# Altium schematic sheet MODULIQ_POE_SPI.SchDoc: Ethernet + PoE
size A3; Author: M.Beldyga; CompanyName: WUT ISE; DrawnBy: M.Beldyga; Organization: WUT ISE; Address1: PW ISE; Address2: Nowowiejska 15/19 00-665 Warsaw; Address3: micbeldyga@gmail.com; SheetNumber: 1; SheetTotal: 1; ModifiedBy: -; CheckedDate: -; Title2: MODULIQ; DivGrp: WUT ISE; Designer: M.Beldyga; ModifiedDate: -; ProjectName: Sensor Box
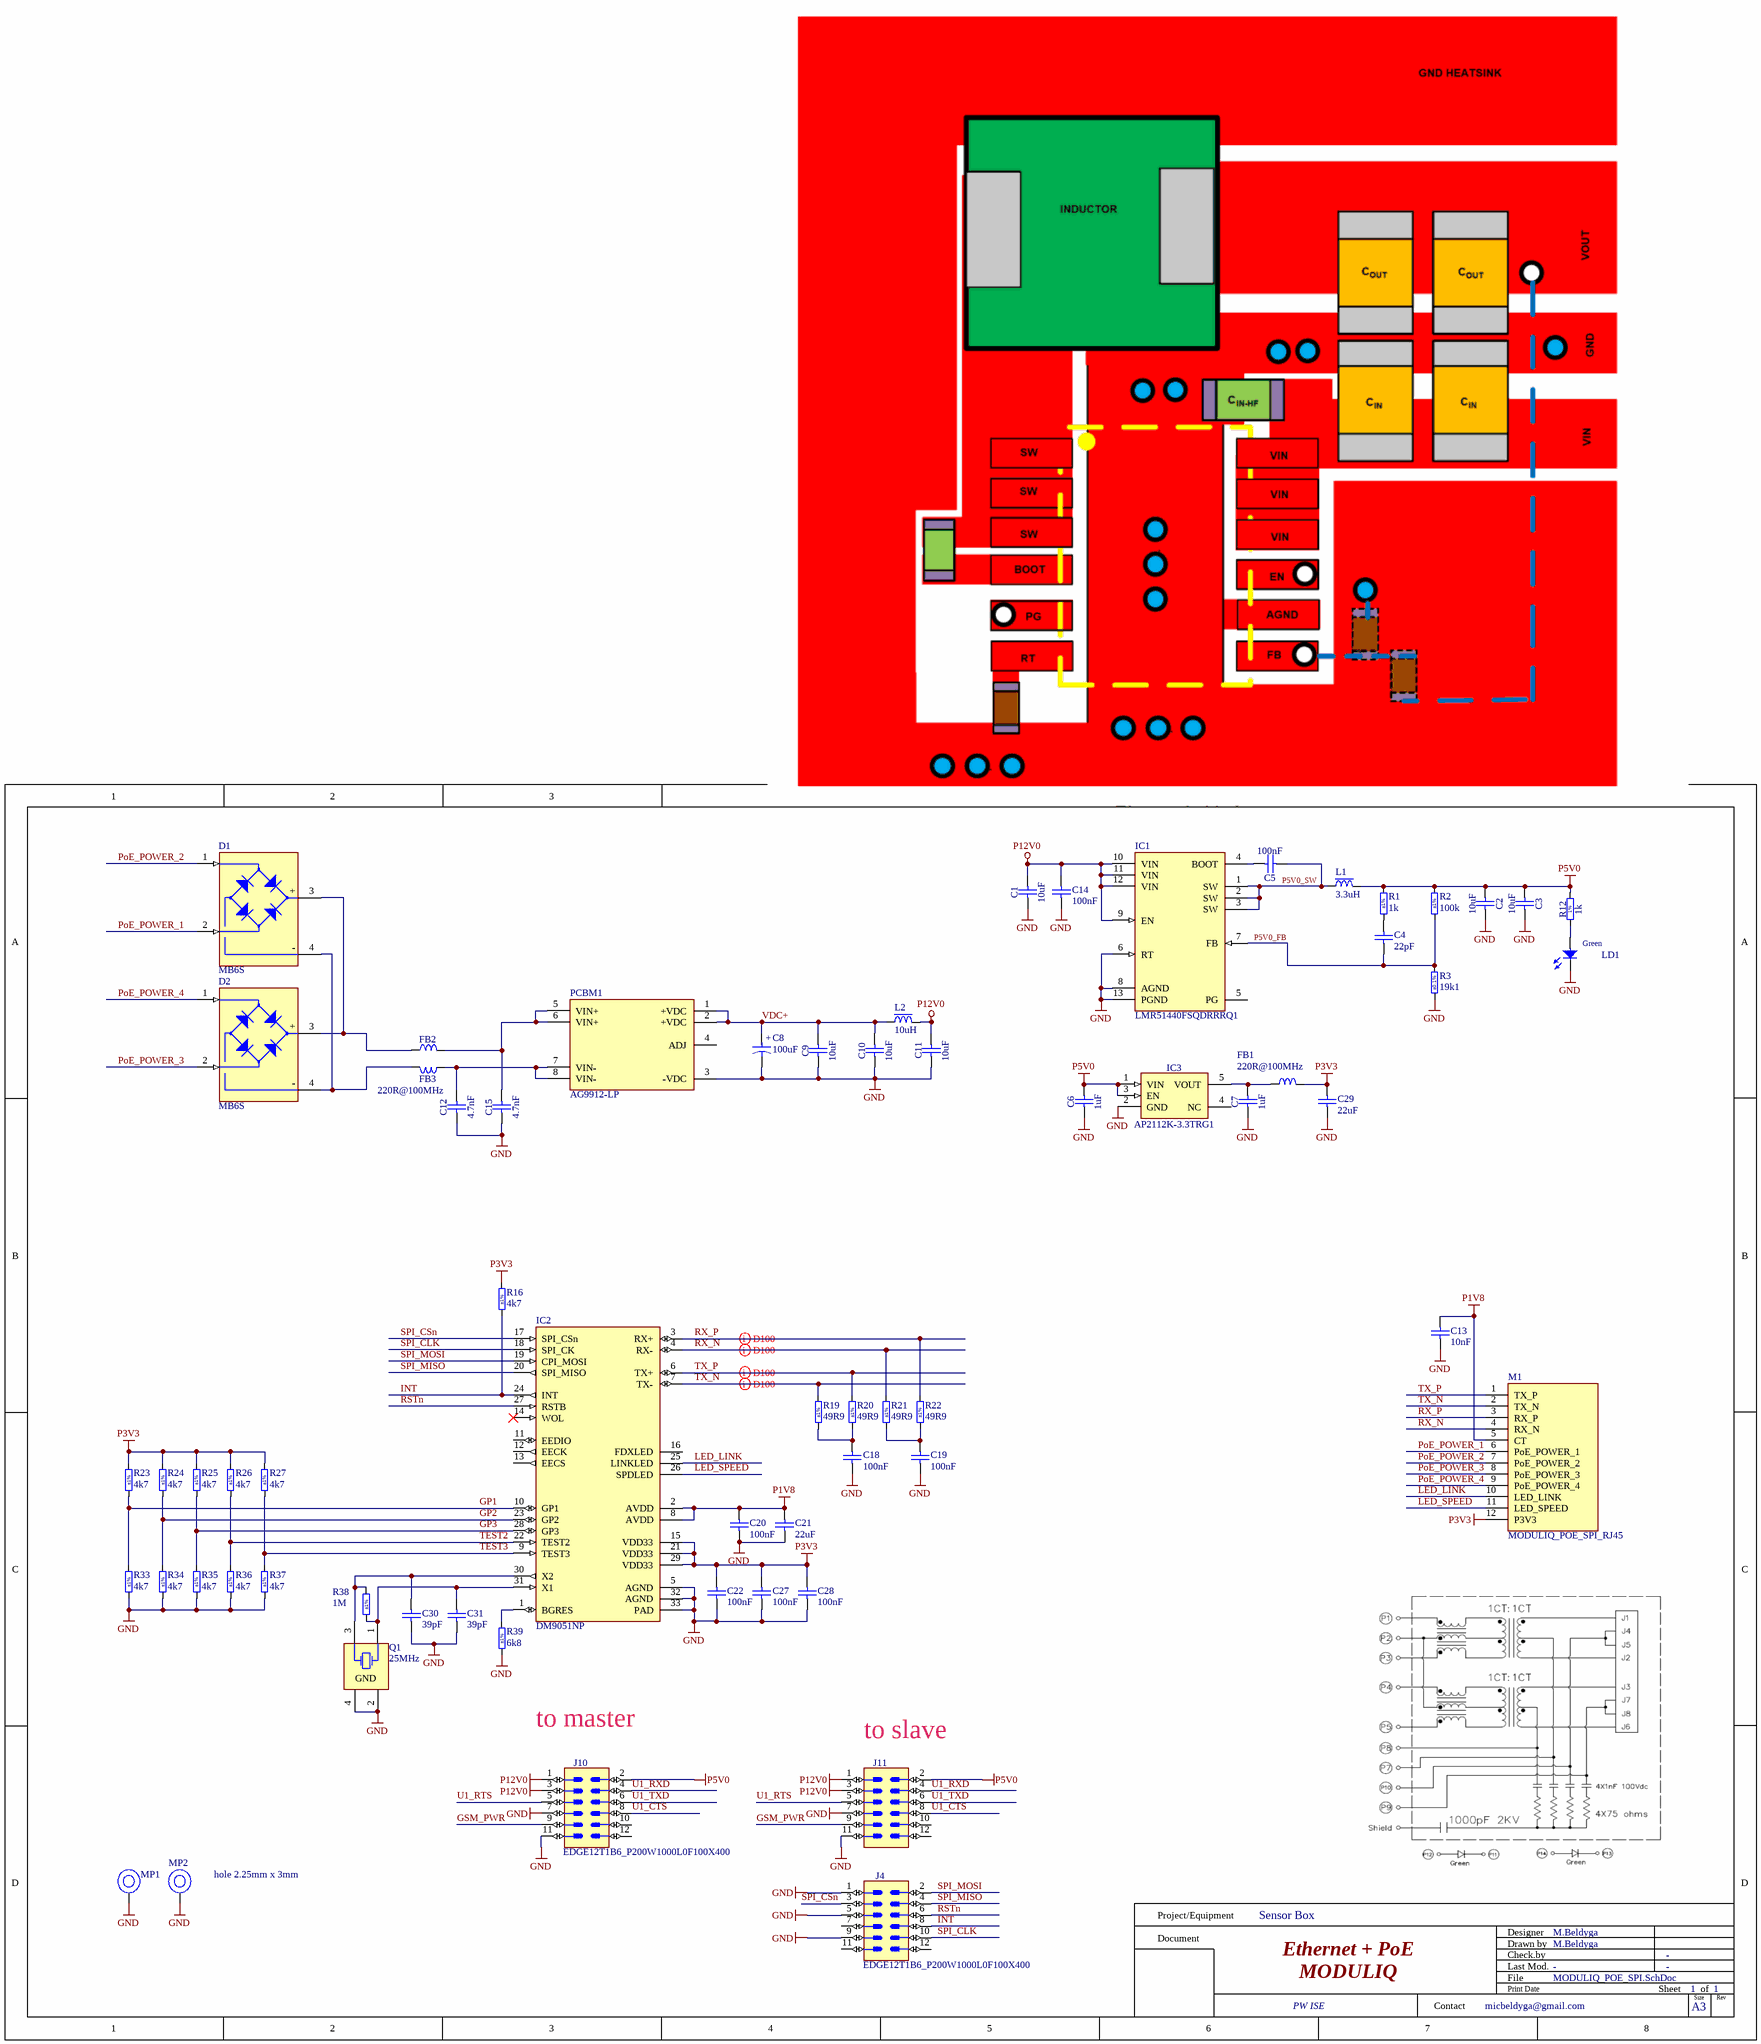
[diagram p0: MODULIQ_POE_SPI.SchDoc]

## Parts
C1  10uF  [CAPC2012X135N]
C2  10uF  [CAPC2012X135N]
C3  10uF  [CAPC2012X135N]
C4  22pF  [CAPC1005X55N]
C5  100nF  [CAPC1005X55N]
C6  1uF  [CAPC1005X55N]
C7  1uF  [CAPC1005X55N]
C8  100uF  [CAPMP7343X430N]
C9  10uF  [CAPC2012X135N]
C10  10uF  [CAPC2012X135N]
C11  10uF  [CAPC2012X135N]
C12  4.7nF  [CAPC3216X140N]
C13  10nF  [CAPC1608X87N]
C14  100nF  [CAPC1005X55N]
C15  4.7nF  [CAPC3216X140N]
C18  100nF  [CAPC1005X55N]
C19  100nF  [CAPC1005X55N]
C20  100nF  [CAPC1005X55N]
C21  22uF  [CAPC1005X70N]
C22  100nF  [CAPC1005X55N]
C27  100nF  [CAPC1005X55N]
C28  100nF  [CAPC1005X55N]
C29  22uF  [CAPC1005X70N]
C30  39pF  [CAPC1005X55N]
C31  39pF  [CAPC1005X55N]
D1  MB6S  [SOIC254P665X290-4N]
D2  MB6S  [SOIC254P665X290-4N]
FB1  220R@100MHz  [INDC2012X105N]
FB2  220R@100MHz  [INDC2012X105N]  (value not drawn)
FB3  220R@100MHz  [INDC2012X105N]
IC1  LMR51440FSQDRRRQ1  [SON50P300X80_HS-13N]
IC2  DM9051NP  [QFN50P500X500X90_HS-33N_DM9051]
IC3  AP2112K-3.3TRG1  [SOT95P285X140-5N]
J4  (no value)  [EDGE12T1B6_P200W1000L0F100X400]
J10  (no value)  [EDGE12T1B6_P200W1000L0F100X400]
J11  (no value)  [EDGE12T5B10_P200W1000L0F100X400]
L1  3.3uH  [IND_COILCRAFT_XAL4030]
L2  10uH  [IND_MURATA-PS_8400]
LD1  Green  [LED_KINGBRIGHT_KP-1608CGCK]
M1  MODULIQ_POE_SPI_RJ45  [MODULIQ_POE_SPI_RJ45]
MP1  M1.6 x 3mm  [97730306330]  (value not drawn)
MP2  hole 2.25mm x 3mm  [9774030943]
PCBM1  AG9912-LP  [Ag9900LP]
Q1  25MHz  [XTAL_EPSON_TSX-3225]
R1  1k  Tolerance: ±1%  [RESC1005X40N]
R2  100k  Tolerance: ±1%  [RESC1005X40N]
R3  19k1  Tolerance: ±0.1%  [RESC1005X35N]
R12  1k  [RESC1005X40N]
R16  4k7  Tolerance: ±1%  [RESC1005X40N]
R19  49R9  Tolerance: ±1%  [RESC1005X40N]
R20  49R9  Tolerance: ±1%  [RESC1005X40N]
R21  49R9  Tolerance: ±1%  [RESC1005X40N]
R22  49R9  Tolerance: ±1%  [RESC1005X40N]
R23  4k7  Tolerance: ±1%  [RESC1005X40N]
R24  4k7  Tolerance: ±1%  [RESC1005X40N]
R25  4k7  Tolerance: ±1%  [RESC1005X40N]
R26  4k7  Tolerance: ±1%  [RESC1005X40N]
R27  4k7  Tolerance: ±1%  [RESC1005X40N]
R33  4k7  Tolerance: ±1%  [RESC1005X40N]
R34  4k7  Tolerance: ±1%  [RESC1005X40N]
R35  4k7  Tolerance: ±1%  [RESC1005X40N]
R36  4k7  Tolerance: ±1%  [RESC1005X40N]
R37  4k7  Tolerance: ±1%  [RESC1005X40N]
R38  1M  Tolerance: ±1%  [RESC1005X40N]
R39  6k8  Tolerance: ±1%  [RESC1005X40N]

## Nets
GND: C1.1 C2.2 C3.2 C6.1 C7.1 C8.2 C9.1 C10.1 C11.1 C12.1 C13.1 C14.1 C15.1 C18.1 C19.1 C20.1 C21.1 C22.1 C27.1 C28.1 C29.1 C30.1 C31.1 IC1.6(RT) IC1.8(AGND) IC1.13(PGND) IC2.5(AGND) IC2.32(AGND) IC2.33(PAD) IC3.2(GND) J4.1 J4.5 J4.9 J10.7 J10.11 J11.7 J11.11 LD1.1(C) MP1.1 MP2.1 PCBM1.3(-VDC) Q1.2(GND) Q1.4(GND) R3.1 R33.1 R34.1 R35.1 R36.1 R37.1 R39.1
P1V8: C13.2 C20.2 C21.2 IC2.2(AVDD) IC2.8(AVDD) M1.5(CT)
P3V3: C22.2 C27.2 C28.2 C29.2 FB1.2 IC2.15(VDD33) IC2.21(VDD33) IC2.29(VDD33) M1.12(P3V3) R16.2 R23.2 R24.2 R25.2 R26.2 R27.2
P5V0: C2.1 C3.1 C6.2 IC3.1(VIN) IC3.3(EN) J10.2 J11.2 L1.2 R1.2 R2.2 R12.2
P12V0: C1.2 C11.2 C14.2 IC1.9(EN) IC1.10(VIN) IC1.11(VIN) IC1.12(VIN) J10.1 J10.3 J11.1 J11.3 L2.2
GP1: IC2.10(GP1) R23.1 R33.2
GP2: IC2.23(GP2) R24.1 R34.2
GP3: IC2.28(GP3) R25.1 R35.2
GSM_PWR: J10.9 J11.9
INT: IC2.24(INT) J4.8 R16.1
LED_LINK: IC2.25(LINKLED) M1.10(LED_LINK)
LED_SPEED: IC2.26(SPDLED) M1.11(LED_SPEED)
P5V0_FB: C4.1 IC1.7(FB) R2.1 R3.2
P5V0_SW: C5.1 IC1.1(SW) IC1.2(SW) IC1.3(SW) L1.1
PoE_POWER_1: D1.2(AC) M1.6(PoE_POWER_1)
PoE_POWER_2: D1.1(AC) M1.7(PoE_POWER_2)
PoE_POWER_3: D2.2(AC) M1.8(PoE_POWER_3)
PoE_POWER_4: D2.1(AC) M1.9(PoE_POWER_4)
RSTn: IC2.27(RSTB) J4.6
RX_N: IC2.4(RX-) M1.4(RX_N) R21.2
RX_P: IC2.3(RX+) M1.3(RX_P) R22.2
SPI_CLK: IC2.18(SPI_CK) J4.10
SPI_CSn: IC2.17(SPI_CSn) J4.3
SPI_MISO: IC2.20(SPI_MISO) J4.4
SPI_MOSI: IC2.19(CPI_MOSI) J4.2
TEST2: IC2.22(TEST2) R26.1 R36.2
TEST3: IC2.9(TEST3) R27.1 R37.2
TX_N: IC2.7(TX-) M1.2(TX_N) R19.2
TX_P: IC2.6(TX+) M1.1(TX_P) R20.2
U1_CTS: J10.8 J11.8
U1_RTS: J10.5 J11.5
U1_RXD: J10.4 J11.4
U1_TXD: J10.6 J11.6
VDC+: C8.1 C9.2 C10.2 L2.1 PCBM1.1(+VDC) PCBM1.2(+VDC)
NetC4_2: C4.2 R1.1
NetC5_2: C5.2 IC1.4(BOOT)
NetC7_2: C7.2 FB1.1 IC3.5(VOUT)
NetC12_2: C12.2 FB3.1 PCBM1.7(VIN-) PCBM1.8(VIN-)
NetC15_2: C15.2 FB2.1 PCBM1.5(VIN+) PCBM1.6(VIN+)
NetC18_2: C18.2 R19.1 R20.1
NetC19_2: C19.2 R21.1 R22.1
NetC30_2: C30.2 IC2.30(X2) Q1.3(X) R38.1
NetC31_2: C31.2 IC2.31(X1) Q1.1(X) R38.2
NetD1_3: D1.3(+) D2.3(+) FB2.2
NetD1_4: D1.4(-) D2.4(-) FB3.2
NetIC2_1: IC2.1(BGRES) R39.2
NetLD1_2: LD1.2(A) R12.1

Not connected (* = marked no-connect by the designer): IC1 5(PG); IC2 11(EEDIO) 12(EECK) 13(EECS) 14(WOL)* 16(FDXLED); IC3 4(NC); J4 7 11 12; J10 10 12; J11 10 12; PCBM1 4(ADJ)

## Layout directives
differential pair; net class D100: RX_N, RX_P, TX_N, TX_P

## Notes on the sheet
- to master
- (near J11) to slave
- Project/Equipment
- Document
- Designer
- Drawn by
- Check.by
- Contact
- File
- Last Mod.
- Print Date
- Sheet
- Size
- A3
- of
- Rev
- (in symbol CTE7343-43_100UF_25V_10%_LESR0150) +
- (in symbol R0402_1K_1%_0.0625W_100PPM) 1%

## Library data of the parts
C1-C3 C9-C11 = CC0805_10UF_16V_10%_X5R: Non-polarised capacitor; Part Description: SMD Multilayer Chip Ceramic Capacitor; Manufacturer: GENERIC; Manufacturer1 Part Number: C0805C106K4PAC; Voltage: 16V; TC: X5R; Tolerance: ±10%; Part Number: CC0805_10UF_16V_10%_X5R; Component Kind: Standard; Component Type: Standard; Pin Count: 2; Value: 10uF; Status: Preferred; Manufacturer Part Number: CC0805_10UF_16V_10%_X5R; Case: 0805; Mounted: Yes; Socket: No; SMD: Yes; Sense: No; Manufacturer1 Example: KEMET; Manufacturer1 ComponentHeight: 1.4mm; HelpURL: \\cern.ch\dfs\Applications\Altium\Datasheets\CC1206_X5R_KEMET.pdf; Author: CERN DEM JLC; CreateDate: 03.12.2007; LatestRevisionDate: 03.12.2007
C4 = CC0402_22PF_50V_5%_C0G: Non-polarised capacitor; Part Description: SMD Multilayer Chip Ceramic Capacitor; Manufacturer: GENERIC; Manufacturer1 Part Number: C0402C220J5GACTU; Voltage: 50V; TC: C0G/NP0; Tolerance: ±5%; Part Number: CC0402_22PF_50V_5%_C0G; Component Kind: Standard; Component Type: Standard; Pin Count: 2; Value: 22pF; Status: Preferred; Manufacturer Part Number: CC0402_22PF_50V_5%_C0G; Case: 0402; Mounted: Yes; Socket: No; SMD: Yes; Sense: No; Manufacturer1 Example: KEMET; Manufacturer1 ComponentHeight: 0.55mm; HelpURL: \\cern.ch\dfs\Applications\Altium\Datasheets\CC0402_C0G_KEMET_(Commercial Grade).pdf; Author: CERN DEM JLC; CreateDate: 12/3/2007; LatestRevisionDate: 12/3/2007
C5 C14 C18-C20 C22 C27 C28 = CC0402_100NF_16V_10%_X5R: Non-polarised capacitor; Part Description: SMD Multilayer Chip Ceramic Capacitor; Manufacturer: GENERIC; Manufacturer1 Part Number: GRM155R61C104KA88D; Voltage: 16V; TC: X5R; Tolerance: ±10%; Part Number: CC0402_100NF_16V_10%_X5R; Component Kind: Standard; Component Type: Standard; Pin Count: 2; Value: 100nF; Status: None; Manufacturer Part Number: CC0402_100NF_16V_10%_X5R; Case: 0402; Mounted: Yes; Socket: No; SMD: Yes; Sense: No; Manufacturer1 Example: MURATA; Manufacturer1 ComponentHeight: 0.55mm; HelpURL: \\cern.ch\dfs\Applications\Altium\Datasheets\CC0402_X5R_MURATA_GRM.pdf; Author: CERN DEM JLC
  C5: CreateDate: 10.12.2013; LatestRevisionDate: 10.12.2013
  C14 C18-C20 C22 C27 C28: CreateDate: 12/10/2013; LatestRevisionDate: 12/10/2013
C6 C7 = CC0402_1UF_16V_10%_X5R: Non-polarised capacitor; Part Description: SMD Multilayer Chip Ceramic Capacitor; Manufacturer: GENERIC; Manufacturer1 Part Number: C1005X5R1C105KT; Voltage: 16V; TC: X5R; Tolerance: ±10%; Part Number: CC0402_1UF_16V_10%_X5R; Component Kind: Standard; Component Type: Standard; Pin Count: 2; Value: 1uF; Status: Preferred; Manufacturer Part Number: CC0402_1UF_16V_10%_X5R; Case: 0402; Mounted: Yes; Socket: No; SMD: Yes; Sense: No; Manufacturer1 Example: TDK; Manufacturer1 ComponentHeight: 0.55mm; HelpURL: \\cern.ch\dfs\Applications\Altium\Datasheets\CC0402_X5R_TDK_C.pdf; Author: CERN DEM JLC; CreateDate: 25.10.2012; LatestRevisionDate: 25.10.2012
C8 = CTE7343-43_100UF_25V_10%_LESR0150: Polarised capacitor; Part Description: Low ESR 0R15 Solid Tantalum Chip Capacitor; Manufacturer: GENERIC; Manufacturer1 Part Number: TPSE107K025R0150; Voltage: 25V; Tolerance: ±10%; Part Number: CTE7343-43_100UF_25V_10%_LESR0150; Component Kind: Standard; Component Type: Standard; Pin Count: 2; Value: 100uF; Status: Preferred; Manufacturer Part Number: CTE7343-43_100UF_25V_10%_LESR0150; Case: E; Mounted: Yes; Socket: No; SMD: Yes; Sense: No; Manufacturer1 Example: AVX; Manufacturer1 ComponentHeight: 4.3mm; HelpURL: \\cern.ch\dfs\Applications\Altium\Datasheets\CTE-LESR_AVX_TPS.pdf; Author: CERN DEM JLC; CreateDate: 12/13/2018; LatestRevisionDate: 12/13/2018
C12 C15 = CAP_SMD_1206_4.7n_500V: Non-polarised capacitor; Part Number: CC1206_4.7NF_500V_10%_X7R; Part Description: SMD Multilayer Chip Ceramic Capacitor; Manufacturer: GENERIC; Manufacturer1 Part Number: C1206C472KCRACTU; Voltage: 500V; TC: X7R; Tolerance: ±10%; Table: Capacitors SMD; Component Kind: Standard; Component Type: Standard; Pin Count: 2; Value: 4.7nF; Status: Preferred; Manufacturer Part Number: CC1206_4.7NF_500V_10%_X7R; Case: 1206; Mounted: Yes; Socket: No; SMD: Yes; Manufacturer1 Example: KEMET; Manufacturer1 ComponentHeight: 1.7mm; HelpURL: \\cern.ch\dfs\Applications\Altium\Datasheets\CC1206_X7R_VISHAY_VJ.pdf; Author: GK; CreateDate: 2007-12-03; LatestRevisionDate: 2007-12-03
C13 = CC0603_10NF_50V_5%_C0G: Non-polarised capacitor; Part Description: SMD Multilayer Chip Ceramic Capacitor; Manufacturer: GENERIC; Manufacturer1 Part Number: C1608C0G1H103J080; Voltage: 50V; TC: C0G/NP0; Tolerance: ±5%; Part Number: CC0603_10NF_50V_5%_C0G; Component Kind: Standard; Component Type: Standard; Pin Count: 2; Value: 10nF; Status: Preferred; Manufacturer Part Number: CC0603_10NF_50V_5%_C0G; Case: 0603; Mounted: Yes; Socket: No; SMD: Yes; Sense: No; Manufacturer1 Example: TDK; Manufacturer1 ComponentHeight: 0.9mm; HelpURL: \\cern.ch\dfs\Applications\Altium\Datasheets\CC0603_C0G_TDK_C.pdf; Author: CERN DEM JLC; CreateDate: 12/10/2014; LatestRevisionDate: 12/10/2014
C21 C29 = CC0402_22UF_6.3V_20%_X5R: Non-polarised capacitor; Part Description: SMD Multilayer Chip Ceramic Capacitor; Manufacturer: GENERIC; Manufacturer1 Part Number: KGM05DR50J226M; Voltage: 6.3V; TC: X5R; Tolerance: ±20%; Part Number: CC0402_22UF_6.3V_20%_X5R; Component Kind: Standard; Component Type: Standard; Pin Count: 2; Value: 22uF; Status: None; Manufacturer Part Number: CC0402_22UF_6.3V_20%_X5R; Case: 0402; Mounted: Yes; Socket: No; SMD: Yes; Sense: No; Manufacturer1 Example: KEMET; Manufacturer1 ComponentHeight: 0.70mm; HelpURL: \\cern.ch\dfs\Applications\Altium\Datasheets\CC0402_X5R_KYOCERA.pdf; Author: CERN DEM HF; CreateDate: 7/31/2024; LatestRevisionDate: 7/31/2024
C30 C31 = CC0402_39PF_100V_5%_C0G_MURATA_GRM1555C2A390JA01: Non-polarised capacitor; Part Description: Chip Multilayer Ceramic Capacitor for General Purpose; Manufacturer: MURATA; Voltage: 100V; TC: C0G/NP0; Tolerance: ±5%; Part Number: CC0402_39PF_100V_5%_C0G_MURATA_GRM1555C2A390JA01; Component Kind: Standard; Component Type: Standard; Pin Count: 2; Value: 39pF; Status: None; Manufacturer Part Number: GRM1555C2A390JA01; Case: 0402; Mounted: Yes; Socket: No; SMD: Yes; Sense: No; ComponentHeight: 0.55mm; HelpURL: \\cern.ch\dfs\Applications\Altium\Datasheets\CC0402_MURATA_GRM1555C2A390JA01.pdf; Author: CERN DEM BC; CreateDate: 9/1/2020; LatestRevisionDate: 9/1/2020
D1 D2 = MB6S: Bridge Rectifier 1AC 2AC 3+ 4-; Part Description: Miniature Glass Passivated Fast Recovery Surface Mount Bridge Rectifier; Manufacturer: VISHAY GENERAL SEMICONDUCTOR; Voltage: 600V; Power: 0.5A; PressFit: No; Bonding: No; Part Number: MB6S; Component Kind: Standard; Component Type: Standard; Device: MB6S; PackageDescription: SOIC, 4-Leads, Body 3.9x4.75mm, Pitch 2.54mm, IPC Medium Density; Manufacturer Part Number: MB6S; Pin Count: 4; Case: SOIC4; Mounted: Yes; Socket: No; SMD: Yes; Sense: No; ComponentHeight: 2.9mm; HelpURL: \\cern.ch\dfs\Applications\Altium\Datasheets\MB6S.pdf; Author: CERN DEM MR; CreateDate: 4/15/2016; LatestRevisionDate: 4/15/2016
FB1-FB3 = IND0805_MURATA_BLM21PG221SN1D: Inductor; Part Description: SMD EMIFIL Suppression Chip Ferrite Bead; Manufacturer: MURATA; Power: 2A; Resistance: 0.05R; Tolerance: ±25%; Table: Inductors SMD; Part Number: IND0805_MURATA_BLM21PG221SN1D; Component Kind: Standard; Component Type: Standard; Pin Count: 2; Value: 220R@100MHz; Status: None; Manufacturer Part Number: BLM21PG221SN1D; Case: 0805; Mounted: Yes; Socket: No; SMD: Yes; ComponentHeight: 1.05mm; HelpURL: \\cern.ch\dfs\Applications\Altium\Datasheets\IND0402_MURATA_BLM21P.pdf; Author: CERN DEM JLC; CreateDate: 2010-01-25; LatestRevisionDate: 2010-01-25
IC1 = LMR51440FSQDRRRQ1: LMR51440-Q1 36V, 4A, Automotive, Synchronous Buck Converter With Low IQ; Manufacturer: Texas Instruments; Arena Part Number: 150-000055; Part Number: LMR51440FSQDRRRQ1; Component Kind: Standard; Component Type: Standard; Device: LMR51440FSQDRRRQ1; PackageDescription: SON, 12-Leads, Body 3.00x3.00mm, Pitch 0.50mm, Thermal Pad 2.50x1.30mm, IPC Medium Density; Part Description: LMR51440-Q1 36V, 4A, Automotive, Synchronous Buck Converter With Low IQ; Manufacturer Part Number: LMR51440FSQDRRRQ1; Pin Count: 12; Case: SON; Status: Active; Author: Michal Beldyga; CreateDate: 1/27/2025; LastRevision: 4/15/2025
IC2 = DM9051NP: Ethernet Controllers 3.135V ~ 3.465V IEEE 802.3 10/100 Base-T/TX PHY MII SPI QFN-32 Ethernet ICs ROHS
IC3 = AP2112K-3.3TRG1: 600mA CMOS Low Dropout Linear Regulator with Enable; Part Description: 3.3V 600mA CMOS Low Dropout Linear Regulator with Enable; Manufacturer: DIODES INCORPORATED; PressFit: No; Bonding: No; Part Number: AP2112K-3.3TRG1; Component Kind: Standard; Component Type: Standard; Device: AP2112K-3.3TRG1; PackageDescription: SOT23, 0.95mm Pitch; 5 Pin, 1.6mm W X 3.0mm L X 1.40mm H body, IPC Medium Density; Manufacturer Part Number: AP2112K-3.3; Pin Count: 5; Case: SOT25; Mounted: Yes; Socket: No; SMD: Yes; Sense: No; ComponentHeight: 1.4mm; HelpURL: \\cern.ch\dfs\Applications\Altium\Datasheets\AP2112K-3.3TRG1.pdf; Author: CERN DEM MR; CreateDate: 13.12.2017; LatestRevisionDate: 27.06.2022
J4 J10 = PCB Edge Connector 12 (2x6): Part Number: EDGE10T1B6_P200W1000L0F100X400; Part Description: 10 Contacts Board Edge Connector, Pitch 2mm, Length 0mm, Width 10mm, Finger Lenght 4mm, Finger Width 1mm; Mounted: No; PressFit: No; Component Kind: Standard (No BOM); Component Type: Standard (No BOM); Pin Count: 12; Socket: No; SMD: No; Sense: No; Status: None; ComponentHeight: 0mm; HelpURL: \\cern.ch\dfs\Applications\Altium\Datasheets\EDGE10T1B6_P200W1000L0F100X400.pdf; Author: CERN DEM MR; CreateDate: 14.02.2018; LatestRevisionDate: 14.02.2018
J11 = PCB Edge Connector 12 (2x6) R: PCB Edge Connector 12 (2x6); Part Description: 12 Contacts Board Edge Connector, Pitch 2mm, Length 0mm, Width 10mm, Finger Lenght 4mm, Finger Width 1mm; Mounted: No; PressFit: No; Part Number: EDGE12T5B10_P200W1000L0F100X400; Component Kind: Standard (No BOM); Component Type: Standard (No BOM); Pin Count: 12; Socket: No; SMD: No; Sense: No; Status: None; ComponentHeight: 0mm; HelpURL: \\cern.ch\dfs\Applications\Altium\Datasheets\EDGE10T5B10_P200W1000L0F100X400.pdf; Author: GK; CreateDate: 14.02.2018; LatestRevisionDate: 14.02.2018
L1 = IND_3.3UH_20%_COILCRAFT_XAL4030: Inductor With Core; Part Description: SMD Shielded Power Inductor; Manufacturer Part Number: XAL4030-332ME; Power: 5A; Resistance: 0.026R; Tolerance: ±20%; Part Number: IND_3.3UH_20%_COILCRAFT_XAL4030; Component Kind: Standard; Component Type: Standard; Pin Count: 2; Value: 3.3uH; Manufacturer: COILCRAFT; Mounted: Yes; Socket: No; SMD: Yes; Sense: No; ComponentHeight: 3.1mm; HelpURL: \\cern.ch\dfs\Applications\Altium\Datasheets\IND_COILCRAFT_XAL4030.pdf; Author: CERN DEM BC; CreateDate: 8/7/2019; LatestRevisionDate: 8/7/2019
L2 = IND_10UH_10%_MURATA-PS_8400: Inductor With Core; Part Description: Miniature Surface Mount Power Inductor (8400 Series); Manufacturer: MURATA POWER SOLUTIONS; Manufacturer Part Number: 84103C; Power: 950mA; Resistance: 0.24R; Tolerance: ±10%; Part Number: IND_10UH_10%_MURATA-PS_8400; Component Kind: Standard; Component Type: Standard; Pin Count: 2; Value: 10uH; Mounted: Yes; Socket: No; SMD: Yes; Sense: No; ComponentHeight: 2.9mm; HelpURL: \\cern.ch\dfs\Applications\Altium\Datasheets\IND_MURATA-PS_8400.pdf; Author: CERN DEM JLC; CreateDate: 7/2/2012; LatestRevisionDate: 7/2/2012
LD1 = LED_KINGBRIGHT_KP-1608CGCK: LED Green 1C 2A; Part Description: 1.6x0.8mm SMD Chip Green LED Lamp; PressFit: No; Bonding: No; Part Number: LED_KINGBRIGHT_KP-1608CGCK; Component Kind: Standard; Component Type: Standard; Color: Green; PackageDescription: SMT Green LED, Case 0603, Body L 1.60mm x W 0.80mm x H 1.10mm; Manufacturer: KINGBRIGHT; Manufacturer Part Number: KP-1608CGCK; Pin Count: 2; Case: 0603; Mounted: Yes; Socket: No; SMD: Yes; Sense: No; ComponentHeight: 1.1mm; HelpURL: \\cern.ch\dfs\Applications\Altium\Datasheets\LED_KINGBRIGHT_KP-1608CGCK.pdf; Author: CERN DEM HF; CreateDate: 01.10.2021; LatestRevisionDate: 01.10.2021
M1 = MODULIQ_POE_SPI_RJ45: MODULIQ POE SPI RJ45 module
MP1 = 97730306330R: WA-SMSI SMT Steel Spacer with internal Thread Bottom closed, OD 3.3mm, M1.6 x 3mm; Manufacturer: Wurth Elektronik; Inside Thread Length: 1.8mm; Surface: Tin; ComponentLink1Description: Website Link; ComponentLink1URL: https://www.we-online.com/redexpert/article/97730306330R?ad; ComponentLink2Description: Datasheet Link; ComponentLink2URL: https://www.we-online.com/redexpert/spec/97730306330R?ad; Manufacturer Part Number: 97730306330R; Category: SMT Spacers; Match Code: WA-SMSI; Mount: Surface Mount; Operating Temperature Max: 150°C; Operating Temperature Min: -55°C; Packaging: Tape and Reel; Height: 3mm; Material: Steel; Outside Diameter: 3.3mm; Thread Size: M1.6
MP2 = 9774030943R: WA-SMST SMT Steel Spacer, OD 4.35mm, hole 2.25mm x 3mm; Manufacturer: Wurth Elektronik; Surface: Tin; Manufacturer Part Number: 9774030943R; Category: SMT Spacers; Match Code: WA-SMST; ComponentLink1Description: Website Link; ComponentLink1URL: https://www.we-online.com/redexpert/article/9774030943R?ad; ComponentLink2Description: Datasheet Link; ComponentLink2URL: https://www.we-online.com/redexpert/spec/9774030943R?ad; Mount: Surface Mount; Operating Temperature Max: 150°C; Operating Temperature Min: -55°C; Packaging: Tape and Reel; Height: 3mm; Inside Diameter: 2.25mm; Material: Steel; Outside Diameter: 4.35mm
PCBM1 = AG9912-LP: Low Profile IEEE802.3 af PoE Module - 12V; Manufacturer: Silvertel; Supplier: Digikey; Supplier Part Number: 5061-AG9912LP-ND; Manufacturer Part Number: AG9912-LP; RoHS: No; Stock: 153; Pricing: 1=9.75, 10=9.5, 50=9.25, 100=9, 200=8.75005, 500=8.60002, 1000=8.00005 (USD)
Q1 = XTAL_25MHZ_EPSON_TSX-3225 25.0000MF10Z-AC: Crystal 4 pins 1=XTAL Control 2=GND3=XTAL 4=GND; Part Description: Tolerance: ±10ppm,  Stability:±10ppm, -20°C to +75°C, 9pF, Surface Mount Quartz Crystal, TX-3225 Series; Manufacturer: EPSON; PressFit: No; Bonding: No; Part Number: XTAL_25MHZ_EPSON_TSX-3225 25.0000MF10Z-AC; Component Kind: Standard; Component Type: Standard; PackageDescription: Crystal, Corner Concave; 4 Pin, 2.50mm L X 3.20mm W X 0.6mm H, TSX-3225 Serie; Value: 25MHz; Manufacturer Part Number: TSX-3225 25.0000MF10Z-AC; Pin Count: 4; Mounted: Yes; Socket: No; SMD: Yes; Sense: No; ComponentHeight: 0.6mm; HelpURL: \\cern.ch\dfs\Applications\Altium\Datasheets\XTAL_EPSON_TSX-3225.pdf; ComponentLink1URL: \\cern.ch\dfs\Applications\Altium\Datasheets\XTAL_EPSON_TSX-3225_Ordering-Informations.pdf; ComponentLink1Description: Ordering Informations; Author: CERN DEM JLC; CreateDate: 4/3/2012; LatestRevisionDate: 10/6/2016
R1 R12 = R0402_1K_1%_0.0625W_100PPM: Resistor - 1%; Part Description: General Purpose Thick Film Chip Resistor; Manufacturer: GENERIC; Manufacturer1 Part Number: 232270671002L; TC: ±100ppm/°C; PressFit: No; Part Number: R0402_1K_1%_0.0625W_100PPM; Component Kind: Standard; Component Type: Standard; Pin Count: 2; Value: 1k; Status: Not Recommended; Power: 0.0625W; Manufacturer Part Number: R0402_1K_1%_0.0625W_100PPM; Case: 0402; Mounted: Yes; Sense: No; Socket: No; SMD: Yes; Manufacturer1 Example: YAGEO PHYCOMP; Manufacturer1 ComponentHeight: 0.4mm; HelpURL: \\cern.ch\dfs\Applications\Altium\Datasheets\R0402_Phycomp_RC0402.pdf; Author: CERN DEM JLC
  R1: CreateDate: 12/3/2007; LatestRevisionDate: 10/17/2012
  R12: Tolerance: ±1%; CreateDate: 03.12.2007; LatestRevisionDate: 17.10.2012
R2 = R0402_100K_1%_0.0625W_100PPM: Resistor - 1%; Part Description: General Purpose Thick Film Chip Resistor; Manufacturer: GENERIC; Manufacturer1 Part Number: 232270671004L; TC: ±100ppm/°C; PressFit: No; Part Number: R0402_100K_1%_0.0625W_100PPM; Component Kind: Standard; Component Type: Standard; Pin Count: 2; Value: 100k; Status: Not Recommended; Power: 0.0625W; Manufacturer Part Number: R0402_100K_1%_0.0625W_100PPM; Case: 0402; Mounted: Yes; Sense: No; Socket: No; SMD: Yes; Manufacturer1 Example: YAGEO PHYCOMP; Manufacturer1 ComponentHeight: 0.4mm; HelpURL: \\cern.ch\dfs\Applications\Altium\Datasheets\R0402_Phycomp_RC0402.pdf; Author: CERN DEM JLC; CreateDate: 12/3/2007; LatestRevisionDate: 10/17/2012
R3 = R0402_19K1_0.1%_0.063W_25PPM: Resistor - 0.1%; Part Description: Thin Film Precision Resistor; Manufacturer: GENERIC; Manufacturer1 Part Number: CPF0402B19K1E1; Power: 0.063W; TC: ±25ppm/°C; PressFit: No; Part Number: R0402_19K1_0.1%_0.063W_25PPM; Component Kind: Standard; Component Type: Standard; Pin Count: 2; Value: 19k1; Status: Not Recommended; Manufacturer Part Number: R0402_19K1_0.1%_0.063W_25PPM; Case: 0402; Mounted: Yes; Sense: No; Socket: No; SMD: Yes; Manufacturer1 Example: TE CONNECTIVITY; Manufacturer1 ComponentHeight: 0.35mm; HelpURL: \\cern.ch\dfs\Applications\Altium\Datasheets\R0402_TYCO_CPF.pdf; Author: CERN DEM MR; CreateDate: 3/9/2017; LatestRevisionDate: 3/9/2017
R16 R23-R27 R33-R37 = R0402_4K7_1%_0.0625W_100PPM: Resistor - 1%; Part Description: General Purpose Thick Film Chip Resistor; Manufacturer: GENERIC; Manufacturer1 Part Number: 232270674702L; TC: ±100ppm/°C; PressFit: No; Part Number: R0402_4K7_1%_0.0625W_100PPM; Component Kind: Standard; Component Type: Standard; Pin Count: 2; Value: 4k7; Status: Not Recommended; Power: 0.0625W; Manufacturer Part Number: R0402_4K7_1%_0.0625W_100PPM; Case: 0402; Mounted: Yes; Sense: No; Socket: No; SMD: Yes; Manufacturer1 Example: YAGEO PHYCOMP; Manufacturer1 ComponentHeight: 0.4mm; HelpURL: \\cern.ch\dfs\Applications\Altium\Datasheets\R0402_Phycomp_RC0402.pdf; Author: CERN DEM JLC; CreateDate: 12/3/2007; LatestRevisionDate: 10/17/2012
R19-R22 = R0402_49R9_1%_0.0625W_100PPM: Resistor - 1%; Part Description: General Purpose Thick Film Chip Resistor; Manufacturer: GENERIC; Manufacturer1 Part Number: 232270674999L or RC0402FR-0749R9L; TC: ±100ppm/°C; PressFit: No; Part Number: R0402_49R9_1%_0.0625W_100PPM; Component Kind: Standard; Component Type: Standard; Pin Count: 2; Value: 49R9; Status: Not Recommended; Power: 0.0625W; Manufacturer Part Number: R0402_49R9_1%_0.0625W_100PPM; Case: 0402; Mounted: Yes; Sense: No; Socket: No; SMD: Yes; Manufacturer1 Example: YAGEO PHYCOMP; Manufacturer1 ComponentHeight: 0.4mm; HelpURL: \\cern.ch\dfs\Applications\Altium\Datasheets\R0402_Phycomp_RC0402.pdf; Author: CERN DEM JLC; CreateDate: 10/24/2012; LatestRevisionDate: 10/24/2012
R38 = R0402_1M_1%_0.0625W_100PPM: Resistor - 1%; Part Description: General Purpose Thick Film Chip Resistor; Manufacturer: GENERIC; Manufacturer1 Part Number: 232270671005L; TC: ±100ppm/°C; PressFit: No; Part Number: R0402_1M_1%_0.0625W_100PPM; Component Kind: Standard; Component Type: Standard; Pin Count: 2; Value: 1M; Status: Not Recommended; Power: 0.0625W; Manufacturer Part Number: R0402_1M_1%_0.0625W_100PPM; Case: 0402; Mounted: Yes; Sense: No; Socket: No; SMD: Yes; Manufacturer1 Example: YAGEO PHYCOMP; Manufacturer1 ComponentHeight: 0.4mm; HelpURL: \\cern.ch\dfs\Applications\Altium\Datasheets\R0402_Phycomp_RC0402.pdf; Author: CERN DEM JLC; CreateDate: 12/3/2007; LatestRevisionDate: 10/17/2012
R39 = R0402_6K8_1%_0.0625W_100PPM: Resistor - 1%; Part Description: General Purpose Thick Film Chip Resistor; Manufacturer: GENERIC; Manufacturer1 Part Number: 232270676802L; TC: ±100ppm/°C; PressFit: No; Part Number: R0402_6K8_1%_0.0625W_100PPM; Component Kind: Standard; Component Type: Standard; Pin Count: 2; Value: 6k8; Status: Not Recommended; Power: 0.0625W; Manufacturer Part Number: R0402_6K8_1%_0.0625W_100PPM; Case: 0402; Mounted: Yes; Sense: No; Socket: No; SMD: Yes; Manufacturer1 Example: YAGEO PHYCOMP; Manufacturer1 ComponentHeight: 0.4mm; HelpURL: \\cern.ch\dfs\Applications\Altium\Datasheets\R0402_Phycomp_RC0402.pdf; Author: CERN DEM JLC; CreateDate: 12/3/2007; LatestRevisionDate: 10/17/2012